# Altium project PCB_MCP_Final.PrjPcb
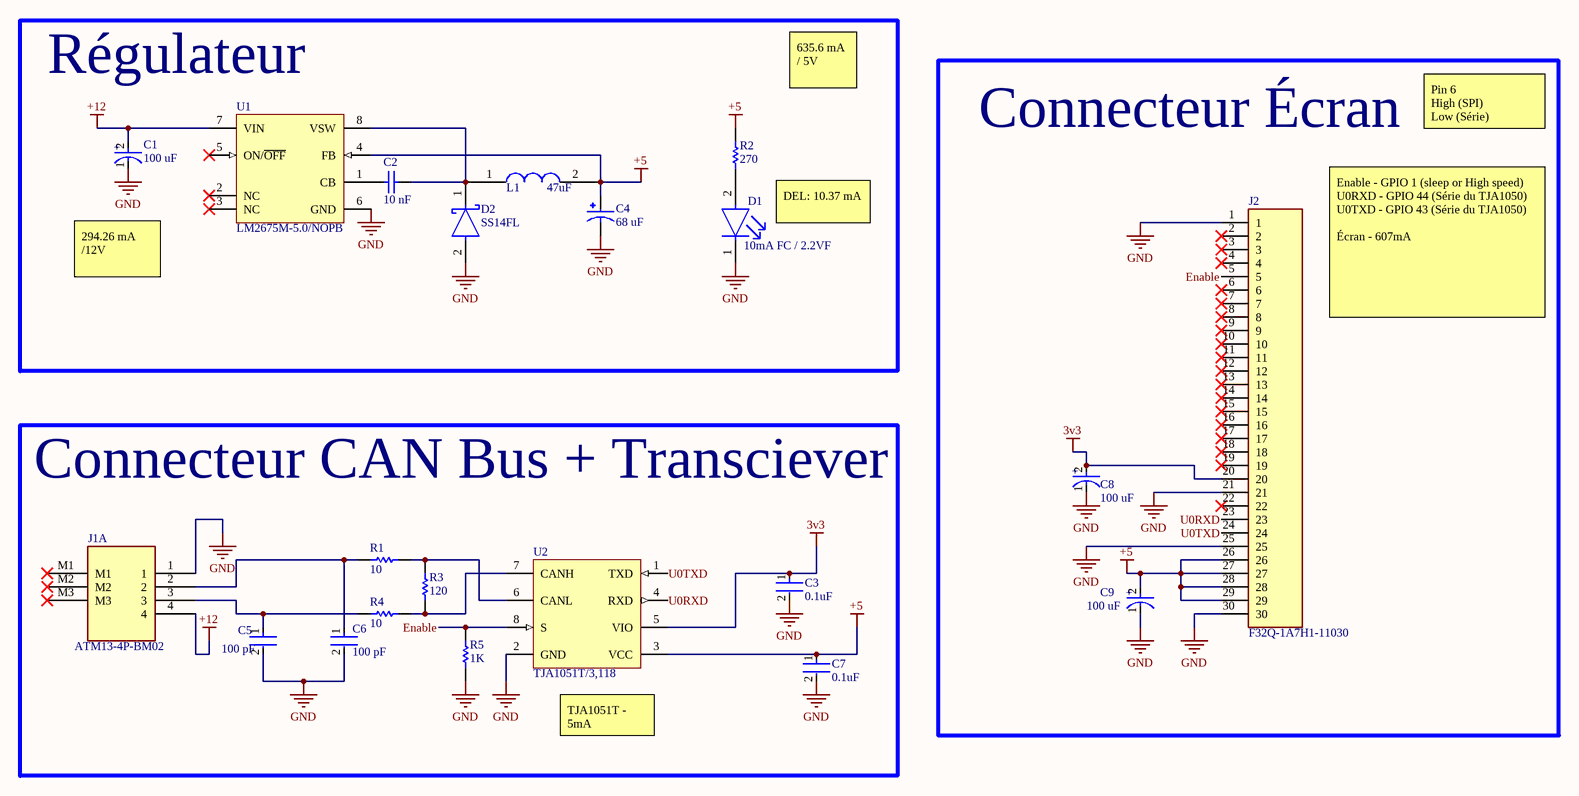
[diagram p0: TEMPLATE_Circuit.SchDoc]
Projet_Concepteur1: Felix-Antoine Guimont; Projet_Concepteur2: Marc-Etienne Gendron fontaine; Projet_Date: 11 fevrier 2024; Projet_nom_du_cours: Projet_Fin_DEC; Projet_PCB_Rev: 2; Projet_SCH_Rev: 00; Projet_stencil_Bot_epaisseur: 0.1 MM; Projet_stencil_Top_epaisseur: 0.1 MM; Projet_Titre: CAN_transciever
2 sheets, 23 parts. Net scope: flat (ports and power ports of the same name join across sheets).
Board file: TEMPLATE_PCB_2L.PcbDoc
Sheets:
  TEMPLATE_Circuit.SchDoc
  TEMPLATE_Title.SchDoc

## Sheet TEMPLATE_Circuit.SchDoc
size Tabloid; Date: Date; Author: Author 1; Revision: 1; SheetNumber: 1; SheetTotal: 3; Size: 11x17; Sheet_Name: Circuit

### Parts
C1  100 uF  [FP-FKF-MFG]
C2  10 nF  [CAPC1608X90X35ML10T15]
C3  0.1uF  [FP-0805-L_2_01_0_2-W_1_25-IPC_B]
C4  68 uF  [CAP_EEEFN1H680XP]
C5  100 pF  [FP-CC0805-0_1-0_7-IPC_A]
C6  100 pF  [FP-CC0805-0_1-0_7-IPC_A]
C7  0.1uF  [FP-0805-L_2_01_0_2-W_1_25-IPC_B]
C8  100 uF  [FP-FKF-MFG]
C9  100 uF  [FP-FKF-MFG]
D1  10mA FC / 2.2VF  [FP-SML-210-MFG]
D2  SS14FL  [FP-425AD-MFG]
J1  ATM13-4P-BM02  [ATM134PBM02]  (part A of 2)
J2  F32Q-1A7H1-11030  [AMPHENOL_F32Q-1A7H1-11030]
L1  47uF  [NPI31W470MTRF]
R1  10  [RESC2013X50X30NL20T20]
R2  270  [RESC2013X60X40NL20T25]
R3  120  [RESC2013X60X40ML20T25]
R4  10  [RESC2013X50X30NL20T20]
R5  1K  [RESC2013X60X35ML10T20]
U1  LM2675M-5.0/NOPB  [D0008A_L]
U2  TJA1051T/3,118  [NXP-SOIC-8_L]

### Blocks framed on the sheet
Régulateur: C1 C2 C4 D1 D2 L1 R2 U1
Connecteur Écran: C8 C9 J2
Connecteur CAN Bus + Transciever: C3 C5-C7 J1 R1 R3-R5 U2

### Nets
3v3: C3.1 C8.2(A) J2.20 U2.5(VIO)
+5: C4.1 C7.1 C9.2(A) J2.26 J2.27 J2.28 J2.29 L1.2 R2.2 U1.4(FB) U2.3(VCC)
+12: C1.2(A) J1.4 U1.7(VIN)
GND: C1.1(C) C3.2 C4.2 C5.2 C6.2 C7.2 C8.1(C) C9.1(C) D1.1(C) D2.2(A) J1.1 J2.1 J2.21 J2.25 J2.30 R5.1 U1.6(GND) U2.2(GND)
Enable: J2.5 R5.2 U2.8(S)
U0RXD: J2.23 U2.4(RXD)
U0TXD: J2.24 U2.1(TXD)
NetC2_1: C2.1 U1.1(CB)
NetC2_2: C2.2 D2.1(C) L1.1 U1.8(VSW)
NetC5_1: C5.1 J1.3 R4.1
NetC6_1: C6.1 J1.2 R1.1
NetD1_2: D1.2(A) R2.1
NetR1_2: R1.2 R3.2 U2.6(CANL)
NetR3_1: R3.1 R4.2 U2.7(CANH)

Not connected (* = marked no-connect by the designer): J1 M1* M2* M3*; J2 2* 3* 4* 6* 7* 8* 9* 10* 11* 12* 13* 14* 15* 16* 17* 18* 19* 22*; U1 2(NC)* 3(NC)* 5(ON/~{OFF})*

### Notes on the sheet
- 635.6 mA / 5V
- Pin 6
  High (SPI)
  Low (Série)
- DEL: 10.37 mA
- 294.26 mA /12V
- Enable - GPIO 1 (sleep or High speed)
  U0RXD - GPIO 44 (Série du TJA1050)
  U0TXD - GPIO 43 (Série du TJA1050)
  Écran - 607mA
- (near U2) TJA1051T - 5mA
- Nom de la feuille
- Titre du projet
- Cours associé au projet
- Taille
- Département
- Technologies du
- Révision
- PCB
- .
- SCH
- Date
- génie électrique
- Feuille
- Variant
- de
- Concepteurs
- (in symbol CMP-2000-06208-3) +

### Library data of the parts
C1 C8 C9 = CMP-2000-06208-3: CAP ALUM 100UF 20% 50V SMD; Leakage Current: 3uA; ESR (Equivalent Series Resistance): 340mR; Material: Aluminium; Ripple Current: 350mA; Life (Hours): 2000Hour; Min Operating Temperature: -55°C; Contact Plating: Tin; REACH SVHC: No SVHC; RoHS Compliant: Yes; Width: 10mm; Radiation Hardening: No; Termination: SMD/SMT; Packaging: Tape and Reel; Max Operating Temperature: 105°C; Case/Package: Radial; Voltage Rating: 50V; Length: 10.2mm; Voltage: 50V; Package Quantity: 1; Voltage Rating (DC): 50V; Height - Seated (Max): 0.402inch; Mount: Surface Mount; Impedance: 340mR; Construction: Cylindrical; Height: 10.2mm; Lead Free: Lead Free; Dielectric Material: Aluminium; Series: FK; Tolerance: 20%; Diameter: 8mm; Ripple Current (AC): 350mA; Capacitance: 100uF; Number of Pins: 2
C2 = CMP-2100-03642-1: Chip Capacitor, 10 nF, +/- 10%, 50 V, -55 to 125 degC, 0603 (1608 Metric), RoHS, Tape and Reel; Manufacturer: Murata; Insulation Resistance: 10GR; Dielectric: X7R; Voltage Rating: 50V; Capacitance: 10nF; Material: Ceramic; Package Quantity: 1; Lead Free: LeadFree; Case/Package: 0603; Termination: SMD/SMT; REACH SVHC: Unknown; Manufacturer URL: http://www.murata.com/; Datasheet URL: http://search.murata.co.jp/Ceramy/image/img/A01X/G101/ENG/GRM188R71H103KA01-01.pdf; Mount: SurfaceMount; Datasheet Version: 42401.0; Number of Pins: 2; Length: 1.6mm; Voltage: 50V; Depth: 0.8mm; Tolerance: 10%; Min Operating Temperature: -55degC; Voltage Rating (DC): 50V; Max Operating Temperature: 125degC; Package Description: 2-Pin Surface Mount Device, Body 1.6 x 0.8 mm; RoHSCompliant: True; Case Code (Imperial): 0603; Width: 0.031inch; Case Code (Metric): 1608; Height: 0.8mm; Package Reference: 0603; Packaging: TapeandReel; Thickness: 0.035inch; Dielectric Material: Ceramic
C3 C7 = CMP-2007-04172-2: Automotive Ceramic Capacitor, 0805, 100nF, 10%, X7R, 15%, 100V; Voltage Rating (DC): 100V; Case Code (Metric): 2012; Mount: Surface Mount; Length: 2.01mm; Depth: 1.25mm; Lead Free: Lead Free; Ratings: AEC-Q200; Max Operating Temperature: 125°C; Tolerance: 10%; Case/Package: 0805; Width: 0.049inch; Package Quantity: 1; Thickness: 0.055inch; Construction: Flat; Min Operating Temperature: -55°C; REACH SVHC: No SVHC; Number of Pins: 2; Radiation Hardening: No; Capacitance: 100nF; Voltage Rating: 100V; Height: 1.4mm; Series: -; Voltage: 100V; Dielectric: X7R; Termination: SMD/SMT; Case Code (Imperial): 0805; RoHS Compliant: Yes; Packaging: Tape and Reel; Dielectric Material: Ceramic
C4 = EEEFN1H680XP: MF: {'manufacturer': u'Panasonic Electronic Components'}; Package: None; Price: None; Value: *; MP: EEEFN1H680XP; Availability: Unavailable
C5 C6 = CMP-03422-001508-1: CAP CER 100PF 50V C0G/NPO 0805; Insulation Resistance: 100GR; Dielectric: C0G; Temperature Coefficient: 30ppm/°C; Dielectric Material: Ceramic; Tolerance: 5%; REACH SVHC: No SVHC; Packaging: Tape and Reel; Max Operating Temperature: 125°C; Case Code (Imperial): 0805; Number of Pins: 2; Height: 0.6mm; Case/Package: 0805; Resistor Type: Ceramic; Length: 2mm; Width: 1.25mm; RoHS Compliant: Yes; Thickness: 0.024inch; Case Code (Metric): 2012; Radiation Hardening: No; Series: CC; Package Quantity: 1; Voltage: 50V; Voltage Rating (DC): 50V; Capacitance: 100pF; Mount: Surface Mount; Voltage Rating: 50V; Min Operating Temperature: -55°C; Lead Free: Lead Free; Termination: SMD/SMT; Depth: 1.25mm
D1 = CMP-08952-000013-1: LED GREEN CLEAR 0805 SMD; Manufacturer Part Number: SML-210MTT86; Manufacturer: ROHM; Forward Current: 20mA; Reverse Voltage: 4V; Peak Emmision Wavelength: 573nm; Forward Voltage: 2.2V; Luminous Intensity: 16mcd; Power Dissipation: 70mW; Led Orientation: Top View; Wavelength: 570nm; Device Class L2: LEDs; Colour: Green; Height: 0.90mm; Ipc Land Pattern Name: DIOCP200125X25; Automotive: No; Temperature Range High: +85°C; Device Class L3: unset; Temperature: -30°C to +85°C; Device Class L1: Optoelectronics; Mouser Description: Standard LEDs - SMD GREEN SMD TRANS LENS; Temperature Range Low: -30°C; Package: SML-210; Digikey Description: LED GREEN CLEAR 0805 SMD; Lead Free: Yes; ComponentLink2URL: https://www.mouser.in/ds/2/348/sml-21-313092.pdf; ComponentLink2Description: Datasheet; Octopart: https://octopart.com/sml-210mtt86-rohm-550711; RoHS: TRUE; Category: Diode
D2 = CMP-07162-000013-1: DIODE SCHOTTKY 40V 1A SOD123F; Manufacturer: ON Semiconductor; Max Junction Temp: +125°C; Value: 60pF; Max Surge Forward Current: 40A; Peak Reverse Current: 30uA; Device Class L3: Schottky Diodes; Reverse Voltage: 40V; Automotive: No; Temperature: -55°C to +125°C; Mouser Description: SS14FL Series 40 V 1 A Surface Mount Schottky Barrier Rectifier - SOD-123F; Octopart: https://octopart.com/ss14fl-on+semiconductor-84331601; Height: 1.08mm; Temperature Range Low: -55°C; Category: Diode; Lead Free: Yes; Device Class L1: Discrete Semiconductors; Digikey Description: DIODE SCHOTTKY 40V 1A SOD123F; RoHS: TRUE; ComponentLink2Description: Datasheet; Manufacturer Part Number: SS14FL; Forward Current: 1A; Capacitance: 60pF; Package: 425AD; Device Class L2: Diodes; Temperature Range High: +125°C; Max Repetitive Reverse Voltage: 40V; ComponentLink2URL: https://www.onsemi.com/pub/Collateral/SS14FL-D.PDF
J2 = F32Q-1A7H1-11030: Flex Connector, 0.50mm Pitch, Height 2.00mm, Right angle, Slider type, ZIF, Upper contact, 30 position , Without MYLAR; MF: Amphenol ICC / Aorora; Package: None; Price: None; Check_prices: https://www.snapeda.com/parts/F32Q-1A7H1-11030/Amphenol/view-part/?ref=eda; Value: *; SnapEDA_Link: https://www.snapeda.com/parts/F32Q-1A7H1-11030/Amphenol/view-part/?ref=snap; MP: F32Q-1A7H1-11030; Availability: In Stock; Purchase-URL: https://pricing.snapeda.com/search/part/F32Q-1A7H1-11030/?ref=eda
L1 = TEMPLATE_Circuit
R1 R4 = CMP-2001-04915-1: Manufacturer: Vishay Dale; Part Number: CRCW080510R0FKEA
R2 = CMP-2001-00596-1: Manufacturer: Panasonic; Part Number: ERA6AEB151V
R3 = CMP-2001-00588-1: Manufacturer: Panasonic; Part Number: ERA6AEB121V
R5 = CMP-2100-03671-1: Chip Resistor, 1 KOhm, +/- 1%, 125 mW, -55 to 155 degC, 0805 (2012 Metric), RoHS, Tape and Reel; Manufacturer: Yageo; Temperature Coefficient: 100ppm/degreesC; Voltage Rating (DC): 150V; Max Power Dissipation: 125mW; Resistance: 1KOhm; Number of Pins: 2; Number of Terminations: 2; Datasheet URL: http://www.yageo.com/NewPortal/yageodocoutput?fileName=/pdf/R-Chip/PYu-RC_Group_51_RoHS_L_5.pdf; Length: 0.079inch; Package Description: 2-Pin Surface Mounted Device, Body 2 x 1.25 mm; Depth: 1.25mm; Height: 0.024inch; Military Standard: Not; Case/Package: 0805; Package Reference: 0805; RoHSCompliant: true; Lead Free: LeadFree; Packaging: TapeandReel; Package Quantity: 1; Datasheet Version: Rev. 5, 10/2016; Tolerance: 1%; Min Operating Temperature: -55degC; Voltage Rating: 150V; Composition: ThickFilm; Case Code (Imperial): 0805; Power Rating: 125mW; Width: 0.049inch; Case Code (Metric): 2012; Manufacturer URL: http://www.yageo.com/; Max Operating Temperature: 155degC; REACH SVHC: Unknown; Termination: SMD/SMT
U1 = CMP-0069-00699-3: SIMPLE SWITCHER® Power Converter High Efficiency 1A Step-Down Voltage Regulator, 8-pin Narrow SOIC, Pb-Free; Manufacturer: Texas Instruments; PowerWise: N; PackageTopMarking: NSZXTT*2675*M5.0; Code_IPC: SOIC127P600-8; ComponentLink1URL: http://www.ti.com/general/docs/lit/getliterature.tsp?genericPartNumber=LM2675&fileType=pdf; ComponentLink1Description: Datasheet URL; CompType: Switcher; PackageDescription: SOIC Narrow, 4.9 x 3.9 x 1.45mm, 8 Lead, 1.27mm Pitch; RoHS: Y; Code_JEDEC: MS-012-AA; PinCount: 8; PackageReference: D0008A
U2 = CMP-2000-07245-1: High-Speed CAN Transceiver, 3 to 5 V, 8-Pin SOIC (SOT96-1), RoHS, Tape and Reel; Manufacturer: NXP; Power Down Mode: Normal/Silent; Rad Hardened: No; Number of Transceivers: 1; Supply Current: 70mA; Operating Supply Voltage (Max): 5.5V; Operating Supply Voltage (Typ): 5V; Operating Supply Voltage (Min): 4.5V; Standard Supported: ISO11898-2; Data Rate: 1Mbps; DELETED: Compliant; Operating Temperature (Min): -40C; Datasheet Version: Rev. 7, 01/2015; Pin Count: 8; Operating Temperature (Max): 125C; Package Description: 8-Pin Small Outline Integrated Circuit, Body 4.9 x 3.9 mm, Pitch 1.27 mm; Category: Transceiver; Packaging: TapeandReel; Mounting: SurfaceMount; Package Reference: SOT96-1; Operating Temperature Classification: Automotive; Mounting Technology: SurfaceMount; Package Type: SO; Manufacturer URL: http://www.nxp.com/; Datasheet URL: http://www.nxp.com/documents/data_sheet/TJA1051.pdf

## Sheet TEMPLATE_Title.SchDoc
size Tabloid; Date: Date; Author: Author 1; Revision: 1; SheetNumber: 3; SheetTotal: 3; Size: 11x17; Sheet_Name: Sheet Description
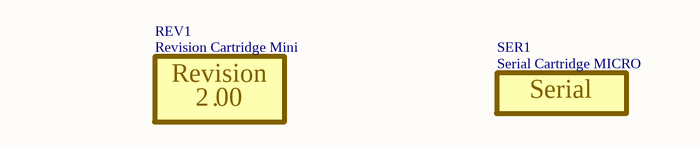
[diagram p1: TEMPLATE_Title.SchDoc]

### Parts
REV1  Revision Cartridge Mini  [REV_REVISION_CARTRIDGE_MINI]  (no BOM)
SER1  Serial Cartridge MICRO  [SER_SERIAL_CARTRIDGE_MICRO]  (no BOM)

### Notes on the sheet
- Projet initial
- Historique de révision
- 1.0
- Légende
- Conversion des boitiers
- Notes Générales
- Métrique
- 1005
- 1608
- Impérial
- 0402
- 0603
- Revision
- .
- Notes PCB
- 2012
- 3216
- 0805
- 1206
- Notes Programmation
- 3225
- 6432
- 1210
- 2512
- Date :
- Variants
- RÉVISION & NUMÉRO DE SÉRIE
- Titre du projet
- Cours associé au projet
- Taille
- Département
- Technologies du
- Révision
- PCB
- SCH
- Date
- génie électrique
- Feuille
- Variant
- de
- Concepteurs
- (in symbol CMP-008-000037-1) Revision; .
- (in symbol CMP-008-000042-1) Serial

### Library data of the parts
REV1 = CMP-008-000037-1: REV - REVISION CARTRIDGE MINI; SHOWDISTANCES: FALSE; NETSCOPE: AnyNet; LAYERKIND: SameLayer; VERTICALGAP: 0mil; UNIT: Imperial; RULEKIND: ComponentClearance; COLLISIONCHECKMODE: 3; Rule: UNIONINDEX=0; Value: *; Note: *; Source: CEGEP_SHERBROOKE_TGE_LIBRARY.SchLib; Package: *; Design Item ID: REV_REVISION_CARTRIDGE_MINI; GAP: 0mil; HelpURL: *; Manufacturer #1: *; Pin Count: 0; Component Type: Standard (No BOM); Power Max: *; Part Number #1: *; Polarized: *; Assembly Type: NONE
SER1 = CMP-008-000042-1: SER - SERIAL CARTRIDGE MICRO; COLLISIONCHECKMODE: 3; RULEKIND: ComponentClearance; SHOWDISTANCES: FALSE; Rule: UNIONINDEX=0; GAP: 0mil; NETSCOPE: AnyNet; UNIT: Imperial; LAYERKIND: SameLayer; HelpURL: *; Polarized: *; Source: CEGEP_SHERBROOKE_TGE_LIBRARY.SchLib; Value: *; Pin Count: 0; Design Item ID: SER_SERIAL_CARTRIDGE_MICRO; Package: *; Manufacturer #1: *; Component Type: Standard (No BOM); Assembly Type: NONE; Note: *; Power Max: *; VERTICALGAP: 0mil; Part Number #1: *